# EAGLE design Daughter2 (EAGLE 9.6.2)
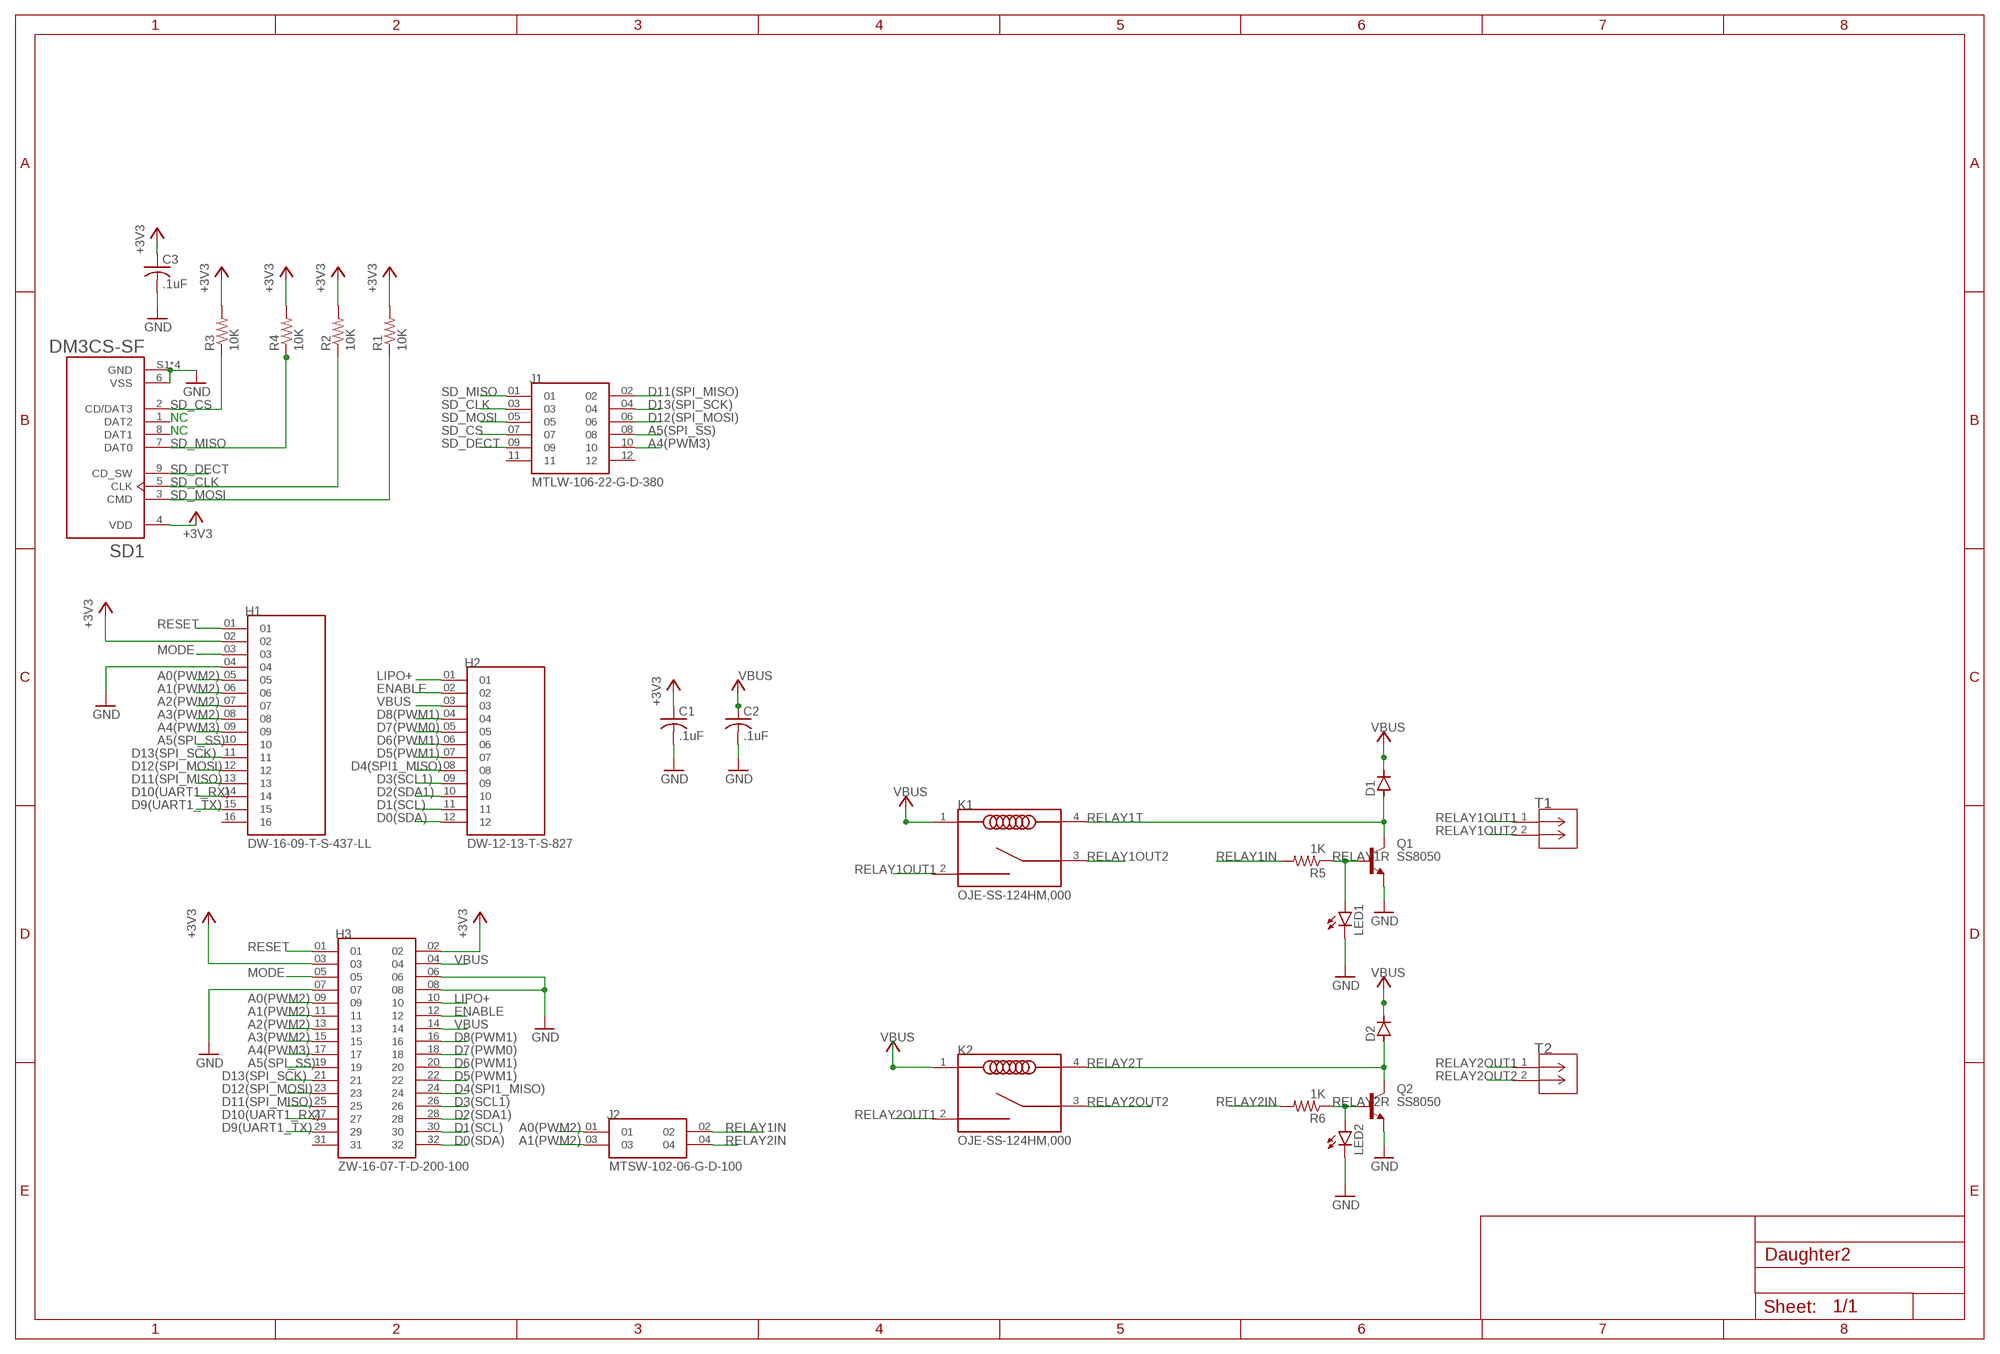
[diagram p0: schematic, sheet 1]

## Parts
C1  .1uF  C-USC0805  [C0805]
C2  .1uF  C-USC0805  [C0805]
C3  .1uF  C-USC0805  [C0805]
D1  D-SOD-80  [SOD80]
D2  D-SOD-80  [SOD80]
H1  DW-16-09-T-S-437-LL  [SAMTEC_DW-16-09-T-S-437-LL]
H2  DW-12-13-T-S-827  [SAMTEC_DW-12-13-T-S-827]
H3  ZW-16-07-T-D-200-100  [SAMTEC_ZW-16-07-T-D-200-100]
J1  MTLW-106-22-G-D-380  [SAMTEC_MTLW-106-22-G-D-380]
J2  MTSW-102-06-G-D-100  [SAMTEC_MTSW-102-06-G-D-100]
K1  OJE-SS-124HM,000  [RELAY_OJE-SS-124HM,000]
K2  OJE-SS-124HM,000  [RELAY_OJE-SS-124HM,000]
LED1  LEDCHIP-LED0603  [CHIP-LED0603]
LED2  LEDCHIP-LED0603  [CHIP-LED0603]
Q1  SS8050  [SOT-23_BEC]
Q2  SS8050  [SOT-23_BEC]
R1  10K  R-US_R0805  [R0805]
R2  10K  R-US_R0805  [R0805]
R3  10K  R-US_R0805  [R0805]
R4  10K  R-US_R0805  [R0805]
R5  1K  R-US_R0805  [R0805]
R6  1K  R-US_R0805  [R0805]
SD1  DM3CS-SF  [HRS_DM3CS-SF]
T1  OSTVN02A150  [CONN_OSTVN02A150_OST]
T2  OSTVN02A150  [CONN_OSTVN02A150_OST]

## Nets
+3V3: C1.1 C3.1 H1.02 H3.02 H3.03 R1.2 R2.2 R3.2 R4.2 SD1.4(VDD)
A0(PWM2): H1.05 H3.09 J2.01
A1(PWM2): H1.06 H3.11 J2.03
A2(PWM2): H1.07 H3.13
A3(PWM2): H1.08 H3.15
A4(PWM3): H1.09 H3.17 J1.10
A5(SPI_SS): H1.10 H3.19 J1.08
D0(SDA): H2.12 H3.32
D1(SCL): H2.11 H3.30
D2(SDA1): H2.10 H3.28
D3(SCL1): H2.09 H3.26
D4(SPI1_MISO): H2.08 H3.24
D5(PWM1): H2.07 H3.22
D6(PWM1): H2.06 H3.20
D7(PWM0): H2.05 H3.18
D8(PWM1): H2.04 H3.16
D9(UART1_TX): H1.15 H3.29
D10(UART1_RX): H1.14 H3.27
D11(SPI_MISO): H1.13 H3.25 J1.02
D12(SPI_MOSI): H1.12 H3.23 J1.06
D13(SPI_SCK): H1.11 H3.21 J1.04
ENABLE: H2.02 H3.12
GND: C1.2 C2.2 C3.2 H1.04 H3.06 H3.07 H3.08 LED1.C LED2.C Q1.E Q2.E SD1.6(VSS) SD1.S1(GND) SD1.S2(GND) SD1.S3(GND) SD1.S5(GND)
LIPO+: H2.01 H3.10
MODE: H1.03 H3.05
RELAY1IN: J2.02 R5.2
RELAY1OUT1: K1.2 T1.1
RELAY1OUT2: K1.3 T1.2
RELAY1R: LED1.A Q1.B R5.1
RELAY1T: D1.2(A) K1.4 Q1.C
RELAY2IN: J2.04 R6.2
RELAY2OUT1: K2.2 T2.1
RELAY2OUT2: K2.3 T2.2
RELAY2R: LED2.A Q2.B R6.1
RELAY2T: D2.2(A) K2.4 Q2.C
RESET: H1.01 H3.01
SD_CLK: J1.03 R2.1 SD1.5(CLK)
SD_CS: J1.07 R3.1 SD1.2(CD/DAT3)
SD_DECT: J1.09 SD1.9(CD_SW)
SD_MISO: J1.01 R4.1 SD1.7(DAT0)
SD_MOSI: J1.05 R1.1 SD1.3(CMD)
VBUS: C2.1 D1.1(C) D2.1(C) H2.03 H3.04 H3.14 K1.1 K2.1 ; supply symbol labelled VCC
Unconnected: H1.16 H3.31 J1.11 J1.12 SD1.1(DAT2) SD1.8(DAT1)

## Notes on the sheet
- NC
- NC

## Library data of the parts
C1-C3 = rcl:C-US: CAPACITOR, American symbol; SPICEPREFIX: C
D1 D2 = semicon-smd-ipc:D-: DIODE unfilled
H1 = DW-16-09-T-S-437-LL:DW-16-09-T-S-437-LL: Check availability <https://pricing.snapeda.com/parts/DW-16-09-T-S-437-LL/Samtec/view-part?ref=eda>; AVAILABILITY: In Stock; DESCRIPTION: 16 Position Header Spacer Connector 0.100 (2.54mm) Tin Through Hole; MF: Samtec; MP: DW-16-09-T-S-437-LL; PACKAGE: None; PRICE: None; PURCHASE-URL: https://pricing.snapeda.com/search/part/DW-16-09-T-S-437-LL/?ref=eda
H2 = DW-12-13-T-S-827:DW-12-13-T-S-827: Check availability <https://pricing.snapeda.com/parts/DW-12-13-T-S-827/Samtec%20Inc./view-part?ref=eda>; AVAILABILITY: In Stock; DESCRIPTION: 12 Position Header Spacer Connector 0.100 (2.54mm) Tin Through Hole; MF: Samtec Inc.; MP: DW-12-13-T-S-827; PACKAGE: None; PRICE: None; PURCHASE-URL: https://pricing.snapeda.com/search/part/DW-12-13-T-S-827/?ref=eda
H3 = ZW-16-07-T-D-200-100:ZW-16-07-T-D-200-100: Check availability <https://pricing.snapeda.com/parts/ZW-16-07-T-D-200-100/Samtec%20Inc./view-part?ref=eda>; AVAILABILITY: In Stock; DESCRIPTION: 32 Position Header Spacer Connector 0.100 (2.54mm) Tin Through Hole; MF: Samtec Inc.; MP: ZW-16-07-T-D-200-100; PACKAGE: None; PRICE: None; PURCHASE-URL: https://pricing.snapeda.com/search/part/ZW-16-07-T-D-200-100/?ref=eda
J1 = MTLW-106-22-G-D-380:MTLW-106-22-G-D-380: Check availability <https://pricing.snapeda.com/parts/MTLW-106-22-G-D-380/Samtec/view-part?ref=eda>; AVAILABILITY: In Stock; DESCRIPTION: CONN HEADER VERT 12POS 2.54MM; MF: Samtec; MP: MTLW-106-22-G-D-380; PACKAGE: None; PRICE: None; PURCHASE-URL: https://pricing.snapeda.com/search/part/MTLW-106-22-G-D-380/?ref=eda
J2 = MTSW-102-06-G-D-100:MTSW-102-06-G-D-100: Check availability <https://pricing.snapeda.com/parts/MTSW-102-06-G-D-100/Samtec%20Inc./view-part?ref=eda>; AVAILABILITY: In Stock; DESCRIPTION: Connector Header Through Hole 4 position 0.100 (2.54mm); MF: Samtec Inc.; MP: MTSW-102-06-G-D-100; PACKAGE: None; PRICE: None; PURCHASE-URL: https://pricing.snapeda.com/search/part/MTSW-102-06-G-D-100/?ref=eda
K1 K2 = OJE-SS-124HM_000:OJE-SS-124HM,000: Electromechanical Relay 24VDC 1.28KOhm 10A SPST-NO( (18.2mm 10.2mm 14.7mm)) THT Miniature Relay Check availability <https://pricing.snapeda.com/parts/OJE-SS-124HM%2C000/TE%20Connectivity/view-part?ref=eda>; AVAILABILITY: In Stock; COMMENT: 6-1419128-4; DESCRIPTION: Electromechanical Relay 24VDC 1.28KOhm 10A SPST-NO( (18.2mm 10.2mm 14.7mm)) THT Miniature Relay; MF: TE Connectivity; MP: OJE-SS-124HM,000; PACKAGE: None; PRICE: None; PURCHASE-URL: https://pricing.snapeda.com/search/part/OJE-SS-124HM,000/?ref=eda
LED1 LED2 = led:LED: LED OSRAM: - CHIPLED LG R971, LG N971, LY N971, LG Q971, LY Q971, LO R971, LY R971 LH N974, LH R974 LS Q976, LO Q976, LY Q976 LO Q996 - Hyper CHIPLED LW Q18S LB Q993, LB Q99A, LB R99A - SideLED LS A670, LO A670, LY A670, LG A670, LP A670 LB A673, LV A673, LT A673, LW A673 LH A674 LY A675 LS A676, LA A676, LO A676, LY A676, LW A676 LS A679, LY A679, LG A679 - Hyper Micro SIDELED® LS Y876, LA Y876, LO Y876, LY Y876 LT Y87S - SmartLED LW L88C, LW L88S LB L89C, LB L89S, LG L890 LS L89K, LO L89K, LY L89K LS L896, LA L896, LO L896, LY L896 - TOPLED LS T670, LO T670, LY T670, LG T670, LP T670 LSG T670, LSP T670, LSY T670, LOP T670, LYG T670 LG T671, LOG T671, LSG T671 LB T673, LV T673, LT T673, LW T673 LH T674 LS T676, LA T676, LO T676, LY T676, LB T676, LH T676, LSB T676, LW T676 LB T67C, LV T67C, LT T67C, LS T67K, LO T67K, LY T67K, LW E67C LS E67B, LA E67B, LO E67B, LY E67B, LB E67C, LV E67C, LT E67C LW T67C LS T679, LY T679, LG T679 LS T770, LO T770, LY T770, LG T770, LP T770 LB T773, LV T773, LT T773, LW T773 LH T774 LS E675, LA E675, LY E675, LS T675 LS T776, LA T776, LO T776, LY T776, LB T776 LHGB T686 LT T68C, LB T68C - Hyper Mini TOPLED® LB M676 - Mini TOPLED Santana® LG M470 LS M47K, LO M47K, LY M47K Source: http://www.osram.convergy.de LUXEON: - LUMILED® LXK2-PW12-R00, LXK2-PW12-S00, LXK2-PW14-U00, LXK2-PW14-V00 LXK2-PM12-R00, LXK2-PM12-S00, LXK2-PM14-U00 LXK2-PE12-Q00, LXK2-PE12-R00, LXK2-PE12-S00, LXK2-PE14-T00, LXK2-PE14-U00 LXK2-PB12-K00, LXK2-PB12-L00, LXK2-PB12-M00, LXK2-PB14-N00, LXK2-PB14-P00, LXK2-PB14-Q00 LXK2-PR12-L00, LXK2-PR12-M00, LXK2-PR14-Q00, LXK2-PR14-R00 LXK2-PD12-Q00, LXK2-PD12-R00, LXK2-PD12-S00 LXK2-PH12-R00, LXK2-PH12-S00 LXK2-PL12-P00, LXK2-PL12-Q00, LXK2-PL12-R00 Source: www.luxeon.com KINGBRIGHT: KA-3528ASYC Source: www.kingbright.com
Q1 Q2 = SS8050:SS8050: NPN de proposito general Vce=40V , Ic=1.5A - 0.3W Check availability <https://pricing.snapeda.com/parts/SS8050/Microdiode%20Electronics/view-part?ref=eda>; AVAILABILITY: In Stock; DESCRIPTION: Bipolar (BJT) Transistor NPN 25V 1.5A 100MHz 625mW Surface Mount SOT-23; MF: Microdiode Electronics; MP: SS8050; PACKAGE: TO-236-3 Microdiode Electronics; PRICE: None; PURCHASE-URL: https://pricing.snapeda.com/search/part/SS8050/?ref=eda
R1-R6 = rcl:R-US_: RESISTOR, American symbol; SPICEPREFIX: R
SD1 = DM3CS-SF:DM3CS-SF: CONN MICRO SD CARD HINGED TYPE Check availability <https://pricing.snapeda.com/parts/DM3CS-SF/Hirose/view-part?ref=eda>; AVAILABILITY: In Stock; DESCRIPTION: 10 (8 + 2) Position Card Connector Secure Digital - microSD™ Surface Mount, Right Angle Gold; MF: Hirose; MP: DM3CS-SF; PACKAGE: None; PRICE: None; PURCHASE-URL: https://pricing.snapeda.com/search/part/DM3CS-SF/?ref=eda
T1 T2 = OSTVN02A150:OSTVN02A150; COPYRIGHT: Copyright (C) 2022 Ultra Librarian. All rights reserved.; MANUFACTURER_PART_NUMBER: OSTVN02A150; MFR_NAME: On Shore Technology

## Net classes
0 default: width 0.305 mm, drill 0.508 mm, clearance 0.254 mm

## Board
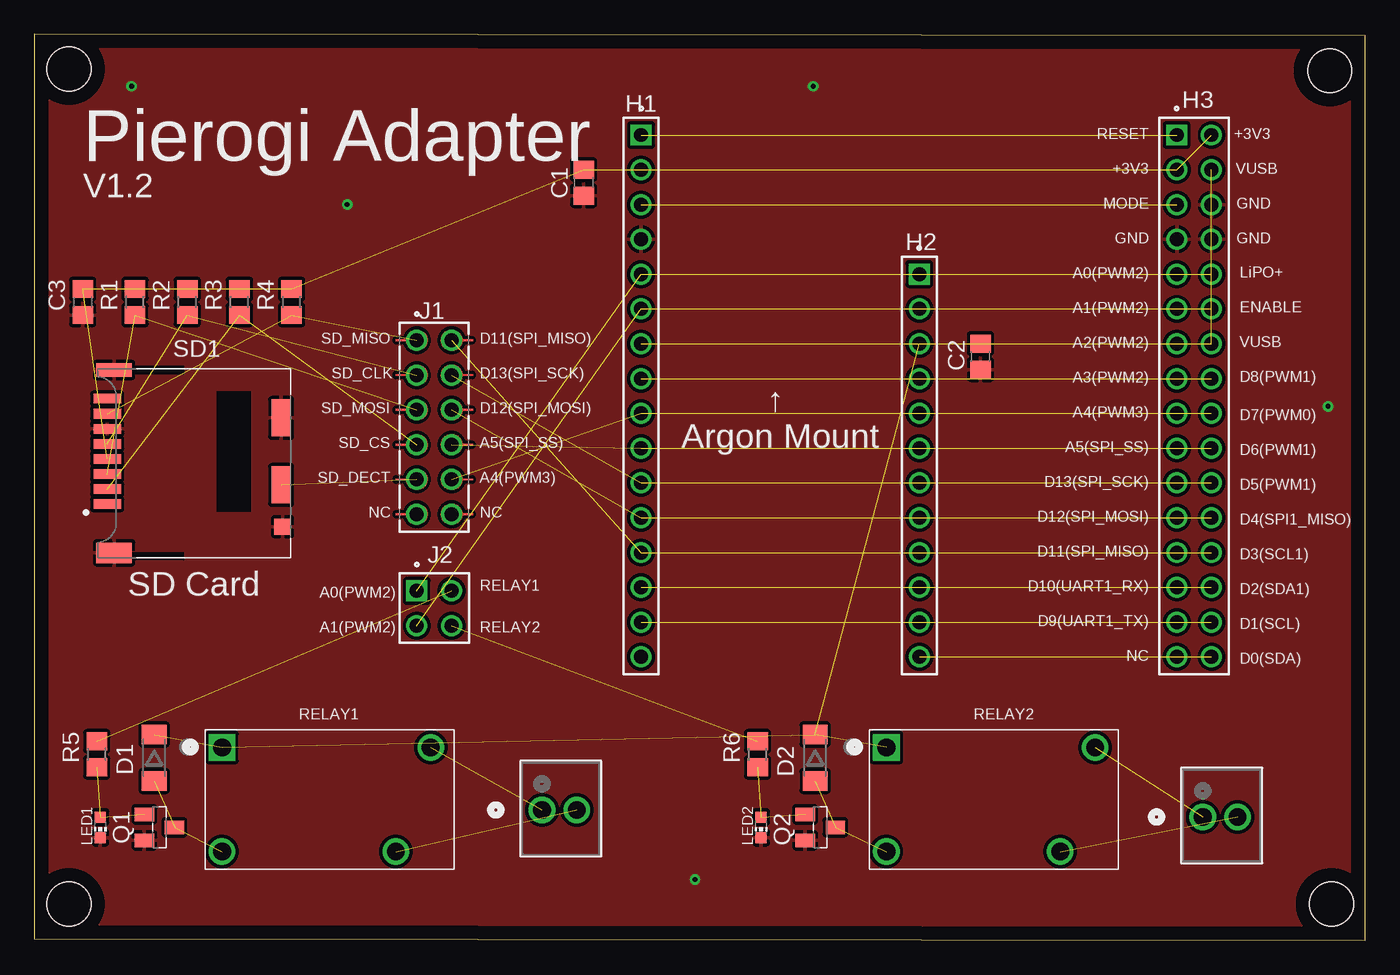
[diagram p1: board, top side]
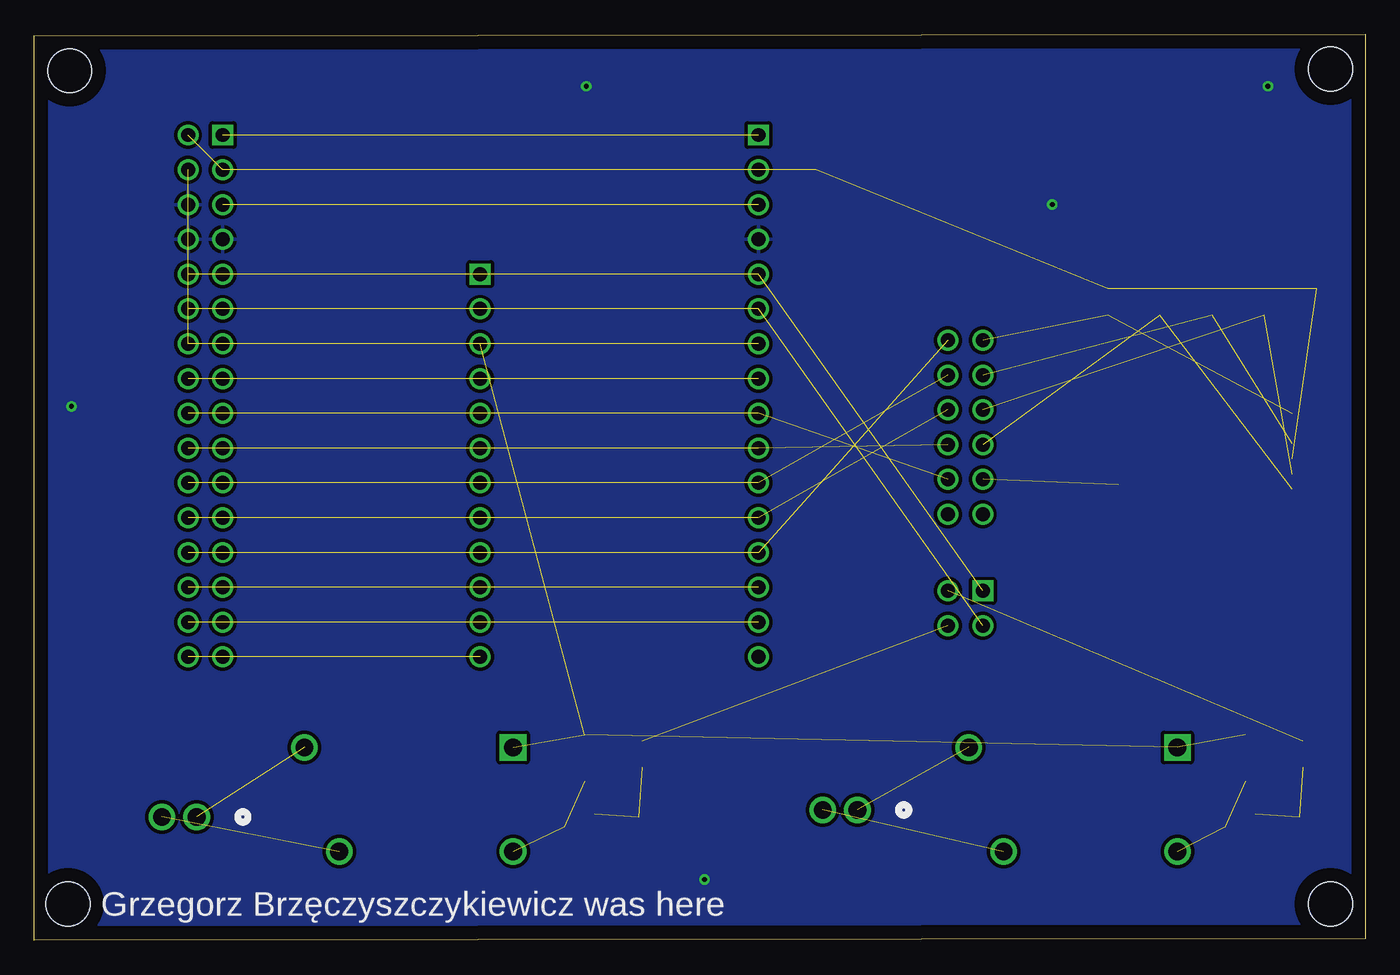
[diagram p2: board, bottom side, seen from below]

Size 97.21 x 66.16 mm. Coordinates in mm from the lower left corner, seen from the top.
Outline: 0,0.13 97.21,0 97.21,66.03 0,66.16 0,0.13
Copper layers (1*16): Top 0.035mm / dielectric 1.5mm / Bottom 0.035mm
Design rules "default": minimum track width 6mil, minimum drill 0.35mm, track to track 6mil, track to pad 6mil, pad to pad 6mil, via to via 6mil, smd to smd 6mil, copper to edge 40mil, drill to drill 6mil, minimum pad ring 10mil, minimum via ring 8mil, stop-mask expansion 4mil, vias tented up to drill 0mil, thermal gap 10mil
Holes 3.2 mm at 2.54,63.63 94.61,63.5 2.54,2.67 94.74,2.67

### Footprints (pad centres in the part's own frame; a part is rotated, then mirrored left to right if it is on the bottom)
C0805 = smd 1.3 x 1.5: 1 -0.95,0; 2 0.95,0
SOD80 = smd 1.4 x 1.8: 1 -1.7,0; 2 1.7,0
SAMTEC_DW-16-09-T-S-437-LL = drill 1.02 pad 1.37 square: 01 0,0 | drill 1.02 pad 1.37: 02 2.54,0; 03 5.08,0; 04 7.62,0; 05 10.16,0; 06 12.7,0; 07 15.24,0; 08 17.78,0; 09 20.32,0; 10 22.86,0; 11 25.4,0; 12 27.94,0; 13 30.48,0; 14 33.02,0; 15 35.56,0; 16 38.1,0
SAMTEC_DW-12-13-T-S-827 = drill 1.02 pad 1.37 square: 01 0,0 | drill 1.02 pad 1.37: 02 2.54,0; 03 5.08,0; 04 7.62,0; 05 10.16,0; 06 12.7,0; 07 15.24,0; 08 17.78,0; 09 20.32,0; 10 22.86,0; 11 25.4,0; 12 27.94,0
SAMTEC_ZW-16-07-T-D-200-100 = drill 1.02 pad 1.37 square: 01 0,0 | drill 1.02 pad 1.37: 02 0,2.54; 03 2.54,0; 04 2.54,2.54; 05 5.08,0; 06 5.08,2.54; 07 7.62,0; 08 7.62,2.54; 09 10.16,0; 10 10.16,2.54; 11 12.7,0; 12 12.7,2.54; 13 15.24,0; 14 15.24,2.54; 15 17.78,0; 16 17.78,2.54; 17 20.32,0; 18 20.32,2.54; 19 22.86,0; 20 22.86,2.54; 21 25.4,0; 22 25.4,2.54; 23 27.94,0; 24 27.94,2.54; 25 30.48,0; 26 30.48,2.54; 27 33.02,0; 28 33.02,2.54; 29 35.56,0; 30 35.56,2.54; 31 38.1,0; 32 38.1,2.54
SAMTEC_MTLW-106-22-G-D-380 = drill 1.02 pad 1.52: 01 -6.35,-1.27; 02 -6.35,1.27; 03 -3.81,-1.27; 04 -3.81,1.27; 05 -1.27,-1.27; 06 -1.27,1.27; 07 1.27,-1.27; 08 1.27,1.27; 09 3.81,-1.27; 10 3.81,1.27; 11 6.35,-1.27; 12 6.35,1.27
SAMTEC_MTSW-102-06-G-D-100 = drill 1.02 pad 1.37 square: 01 0,0 | drill 1.02 pad 1.37: 02 0,2.54; 03 2.54,0; 04 2.54,2.54
RELAY_OJE-SS-124HM,000 = drill 1.3 square: 1 -7.62,3.8 | drill 1.3: 2 7.62,3.8; 3 5.08,-3.8; 4 -7.62,-3.8
CHIP-LED0603 = smd 0.8 x 0.8: A 0,-0.75; C 0,0.75
SOT-23_BEC = smd 1 x 1.4: B -0.95,-1.1; C 0,1.1; E 0.95,-1.1
R0805 = smd 1.3 x 1.5: 1 -0.95,0; 2 0.95,0
HRS_DM3CS-SF = smd 0.7 x 2: 1 3.2,-6.35; 2 2.1,-6.35; 3 1,-6.35; 4 -0.1,-6.35; 5 -1.2,-6.35; 6 -2.3,-6.35; 7 -3.4,-6.35; 8 -4.5,-6.35 | smd 2.7 x 1.4: 9 1.8,6.35; S3 -3.1,6.35 | smd 1 x 2.6: S1 -6.6,-5.85 | smd 1.5 x 2.6: S2 6.75,-5.85 | smd 1.2 x 1.2: S5 4.85,6.45
CONN_OSTVN02A150_OST = drill 1.295 pad 1.803: 1 0,0; 2 2.54,0

### Placement (x,y rotation side)
C1  40.13,55.32 270 top
C2  69.11,42.62 270 top
C3  3.56,46.61 270 top
D1  8.76,13.34 270 top
D2  57.02,13.34 270 top
H1  44.32,58.8 270 top
H2  64.64,48.64 270 top
H3  83.44,58.8 270 top
J1  29.21,37.47 270 top
J2  27.94,25.53 270 top
K1  21.34,10.29 0 top
K2  69.85,10.29 0 top
LED1  4.83,8.26 180 top
LED2  53.09,8.26 180 top
Q1  9.14,8.26 270 top
Q2  57.4,8.26 270 top
R1  7.37,46.61 90 top
R2  11.18,46.61 90 top
R3  14.99,46.61 90 top
R4  18.8,46.61 90 top
R5  4.57,13.59 90 top
R6  52.83,13.59 90 top
SD1  11.68,35.05 270 top
T1  37.08,9.53 0 top
T2  85.34,9.02 0 top

### Tracks (layer width: path | path; a pad name or v marks a point on that pad's centre or on a via)
+3V3  (9 unrouted)
A0(PWM2)  (2 unrouted)
A1(PWM2)  (2 unrouted)
A2(PWM2)  (1 unrouted)
A3(PWM2)  (1 unrouted)
A4(PWM3)  (2 unrouted)
A5(SPI_SS)  (2 unrouted)
D0(SDA)  (1 unrouted)
D1(SCL)  (1 unrouted)
D2(SDA1)  (1 unrouted)
D3(SCL1)  (1 unrouted)
D4(SPI1_MISO)  (1 unrouted)
D5(PWM1)  (1 unrouted)
D6(PWM1)  (1 unrouted)
D7(PWM0)  (1 unrouted)
D8(PWM1)  (1 unrouted)
D9(UART1_TX)  (1 unrouted)
D10(UART1_RX)  (1 unrouted)
D11(SPI_MISO)  (2 unrouted)
D12(SPI_MOSI)  (2 unrouted)
D13(SPI_SCK)  (2 unrouted)
ENABLE  (1 unrouted)
GND  (via drill 0.35)
  other vias: 7.11,62.36 22.86,53.72 56.9,62.36 94.49,38.99 48.26,4.45
  pour Top: 0,67.44 97.79,67.44 97.79,-1.14 -1.27,-1.14 -1.27,67.44
  pour Bottom: -1.27,68.71 99.06,68.71 99.06,-2.41 -2.54,-2.41 -2.54,68.71
LIPO+  (1 unrouted)
MODE  (1 unrouted)
RELAY1IN  (1 unrouted)
RELAY1OUT1  (1 unrouted)
RELAY1OUT2  (1 unrouted)
RELAY1R  (2 unrouted)
RELAY1T  (2 unrouted)
RELAY2IN  (1 unrouted)
RELAY2OUT1  (1 unrouted)
RELAY2OUT2  (1 unrouted)
RELAY2R  (2 unrouted)
RELAY2T  (2 unrouted)
RESET  (1 unrouted)
SD_CLK  (2 unrouted)
SD_CS  (2 unrouted)
SD_DECT  (1 unrouted)
SD_MISO  (2 unrouted)
SD_MOSI  (2 unrouted)
VBUS  (7 unrouted)

### Text on the board
tNames: RESET | +3V3 | +3V3 | VUSB | V1.2 | MODE | GND | Pierogi Adapter | GND | GND | A0(PWM2) | LiPO+ | A1(PWM2) | ENABLE | SD_MISO | D11(SPI_MISO) | A2(PWM2) | VUSB | A3(PWM2) | SD_CLK | D13(SPI_SCK) | D8(PWM1) | SD_MOSI | D12(SPI_MOSI) | A4(PWM3) | D7(PWM0) | A5(SPI_SS) | SD_CS | A5(SPI_SS) | ↑ / Argon Mount | D6(PWM1) | SD_DECT | A4(PWM3) | D13(SPI_SCK) | D5(PWM1) | D12(SPI_MOSI) | NC | NC | D4(SPI1_MISO) | D11(SPI_MISO) | D3(SCL1) | SD Card | D10(UART1_RX) | RELAY1 | D2(SDA1) | A0(PWM2) | D9(UART1_TX) | A1(PWM2) | RELAY2 | D1(SCL) | NC | D0(SDA) | RELAY1 | RELAY2
bNames: Grzegorz Brzęczyszczykiewicz was here